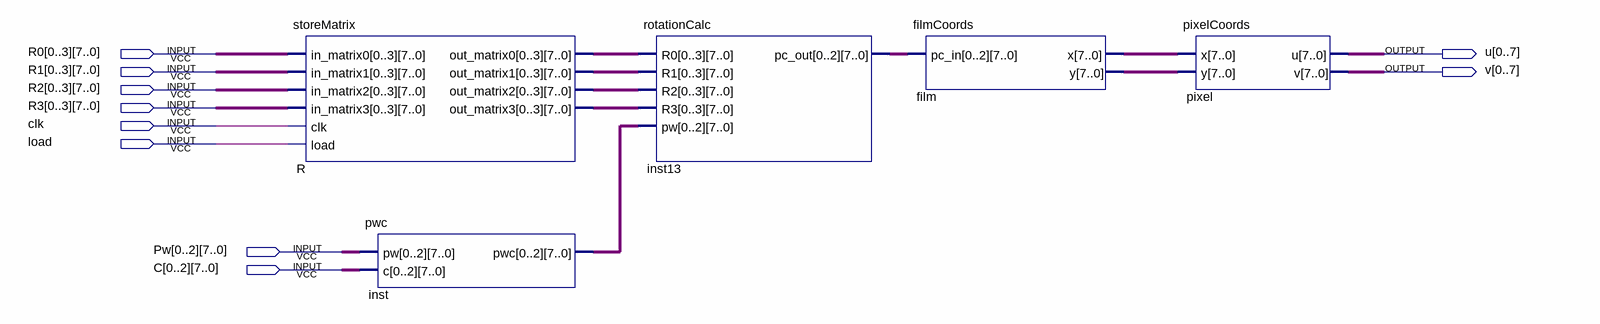
[diagram p0: schematic sheet]
// Quartus schematic cameraProjection.bdf as structural Verilog: 5 symbols, 10 pins
module cameraProjection (
  input  [7:0] R0_0,
  input  [7:0] R0_1,
  input  [7:0] R0_2,
  input  [7:0] R0_3,
  input  [7:0] R1_0,
  input  [7:0] R1_1,
  input  [7:0] R1_2,
  input  [7:0] R1_3,
  input  [7:0] R2_0,
  input  [7:0] R2_1,
  input  [7:0] R2_2,
  input  [7:0] R2_3,
  input  [7:0] R3_0,
  input  [7:0] R3_1,
  input  [7:0] R3_2,
  input  [7:0] R3_3,
  input  clk,
  input  load,
  input  [7:0] Pw_0,
  input  [7:0] Pw_1,
  input  [7:0] Pw_2,
  input  [7:0] C_0,
  input  [7:0] C_1,
  input  [7:0] C_2,
  output [0:7] u,
  output [0:7] v
);

  wire [7:0] film_x, film_y;
  wire [23:0] inst13_pc_out, inst_pwc;
  wire [31:0] R_out_matrix0, R_out_matrix1, R_out_matrix2, R_out_matrix3;

  storeMatrix R (
    .in_matrix0({R0_0, R0_1, R0_2, R0_3}), .in_matrix1({R1_0, R1_1, R1_2, R1_3}),
    .in_matrix2({R2_0, R2_1, R2_2, R2_3}), .in_matrix3({R3_0, R3_1, R3_2, R3_3}), .clk(clk), .load(load),
    .out_matrix0(R_out_matrix0), .out_matrix1(R_out_matrix1), .out_matrix2(R_out_matrix2),
    .out_matrix3(R_out_matrix3));
  pwc inst (.pw({Pw_0, Pw_1, Pw_2}), .c({C_0, C_1, C_2}), .pwc(inst_pwc));
  rotationCalc inst13 (
    .R0(R_out_matrix0), .R1(R_out_matrix1), .R2(R_out_matrix2), .R3(R_out_matrix3), .pw(inst_pwc),
    .pc_out(inst13_pc_out));
  filmCoords film (.pc_in(inst13_pc_out), .x(film_x), .y(film_y));
  pixelCoords pixel (.x(film_x), .y(film_y), .u(u), .v(v));
endmodule
